# Altium schematic sheet ResistorNetwork_forTest.SchDoc: Resistor Network as Voltage Divider for Testing
size A4; Date: Mar 22, 2023; SheetNumber: 2; SheetTotal: 2
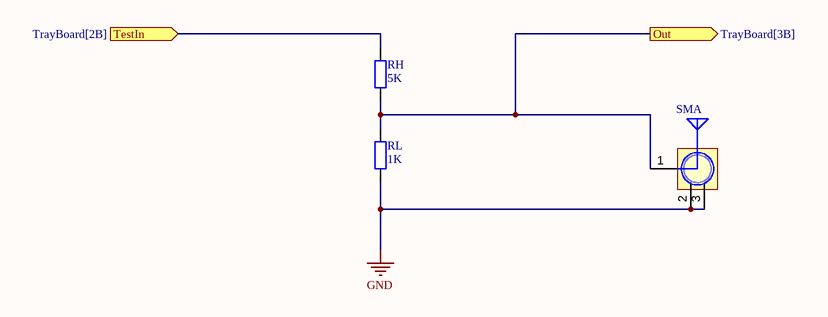
[diagram p0: ResistorNetwork_forTest.SchDoc]

## Parts
RH  5K  [R 0402_L]
RL  1K  [R 0402_L]
SMA  SMA RF 立式  [SMA-KE-LI]  (value not drawn)

## Ports
Out (out, see TrayBoard[3B]), TestIn (in, see TrayBoard[2B])

## Nets
GND: RL.1 SMA.2(GND) SMA.3(GND)
Out: RH.1 RL.2 SMA.1(ANT) ; port Out
TestIn: RH.2 ; port TestIn

## Notes on the sheet
- Title
- FileName:
- Version:
- Date:
- Project
- Designed By:
- Descriptions:
- Sheet:
- of

## Library data of the parts
RH = R: 贴片电阻 0.1% / C3202451; 版权归属: 来自淘宝 ID：黄晶宝石; 封装库来自淘宝卖家 ID：黄晶宝石: 其他店铺购入均为盗版，不享受售后技术支持服务，请立即申请退款; BOM名称: 贴片电阻; 联系售后: https://shop463601444.taobao.com
RL = R: 贴片电阻 0.1%; 版权归属: 来自淘宝 ID：黄晶宝石; 封装库来自淘宝卖家 ID：黄晶宝石: 其他店铺购入均为盗版，不享受售后技术支持服务，请立即申请退款; BOM名称: 贴片电阻; 联系售后: https://shop463601444.taobao.com
SMA = SMA: BOM名称: SMA-2.4G射频天线接口; 版权归属: 封装库来自淘宝 ID：黄晶宝石; 唯一出售店铺网址: https://shop463601444.taobao.com